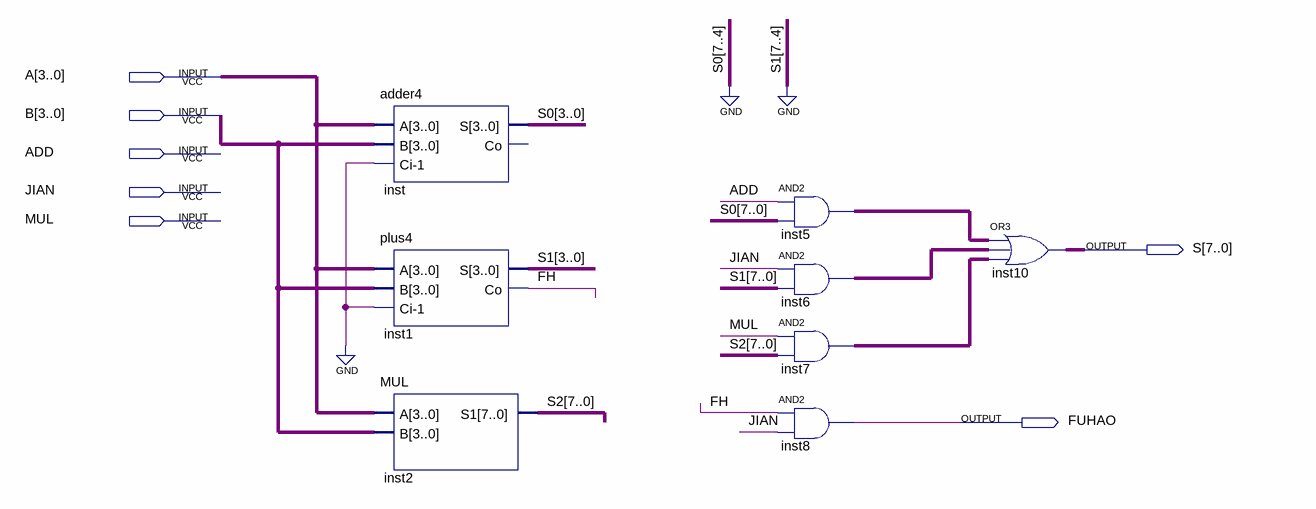
[diagram p0: schematic sheet]
// Quartus schematic zonghe-jsq.bdf as structural Verilog: 8 symbols, 7 pins
module \zonghe-jsq  (
  input  [3:0] A,
  input  [3:0] B,
  input  ADD,
  input  JIAN,
  input  MUL,
  output [7:0] S,
  output FUHAO
);

  wire FH;
  wire [3:0] S0, S1;
  wire [7:0] inst5_out, inst6_out, inst7_out, S2;

  adder4 inst (.A(A), .B(B), .\Ci-1 (1'b0), .S(S0));  // open: Co
  plus4 inst1 (.A(A), .B(B), .\Ci-1 (1'b0), .S(S1), .Co(FH));
  MUL inst2 (.A(A), .B(B), .S1(S2));
  assign inst5_out = {8{ADD}} & {4'b0000, S0};  // AND2 inst5, 8 bits wide
  assign inst6_out = {8{JIAN}} & {4'b0000, S1};  // AND2 inst6, 8 bits wide
  assign inst7_out = {8{MUL}} & S2;  // AND2 inst7, 8 bits wide
  and inst8 (FUHAO, FH, JIAN);
  assign S = inst5_out | inst6_out | inst7_out;  // OR3 inst10, 8 bits wide
endmodule
